# Altium schematic sheet FMC_CONNECTORS.SchDoc: FMC Connectors
size 420 x 297 mm; CheckedBy: T.Janicki; CompanyName: Creotech Instruments SA; DrawnBy: G.Kasprowicz; Organization: CERN; Address1: European Organization for Nuclear Research; Address2: CH-1211 Geneve 23 - Switzerland; DocumentNumber: 10; Revision: -; SheetNumber: 10; SheetTotal: 21; EDA_Number: EDA-xxxx; Projet: Simple VME FMC Carrier; CreateDate: 20/11/2012; CheckedDate: 30/04/2012; DivGrp: BE-CO; Designer: G.Kasprowicz; DocumentName: FMCConnector.SchDoc; ModifiedDate: -; Rule: PcbType=ProtelPcb
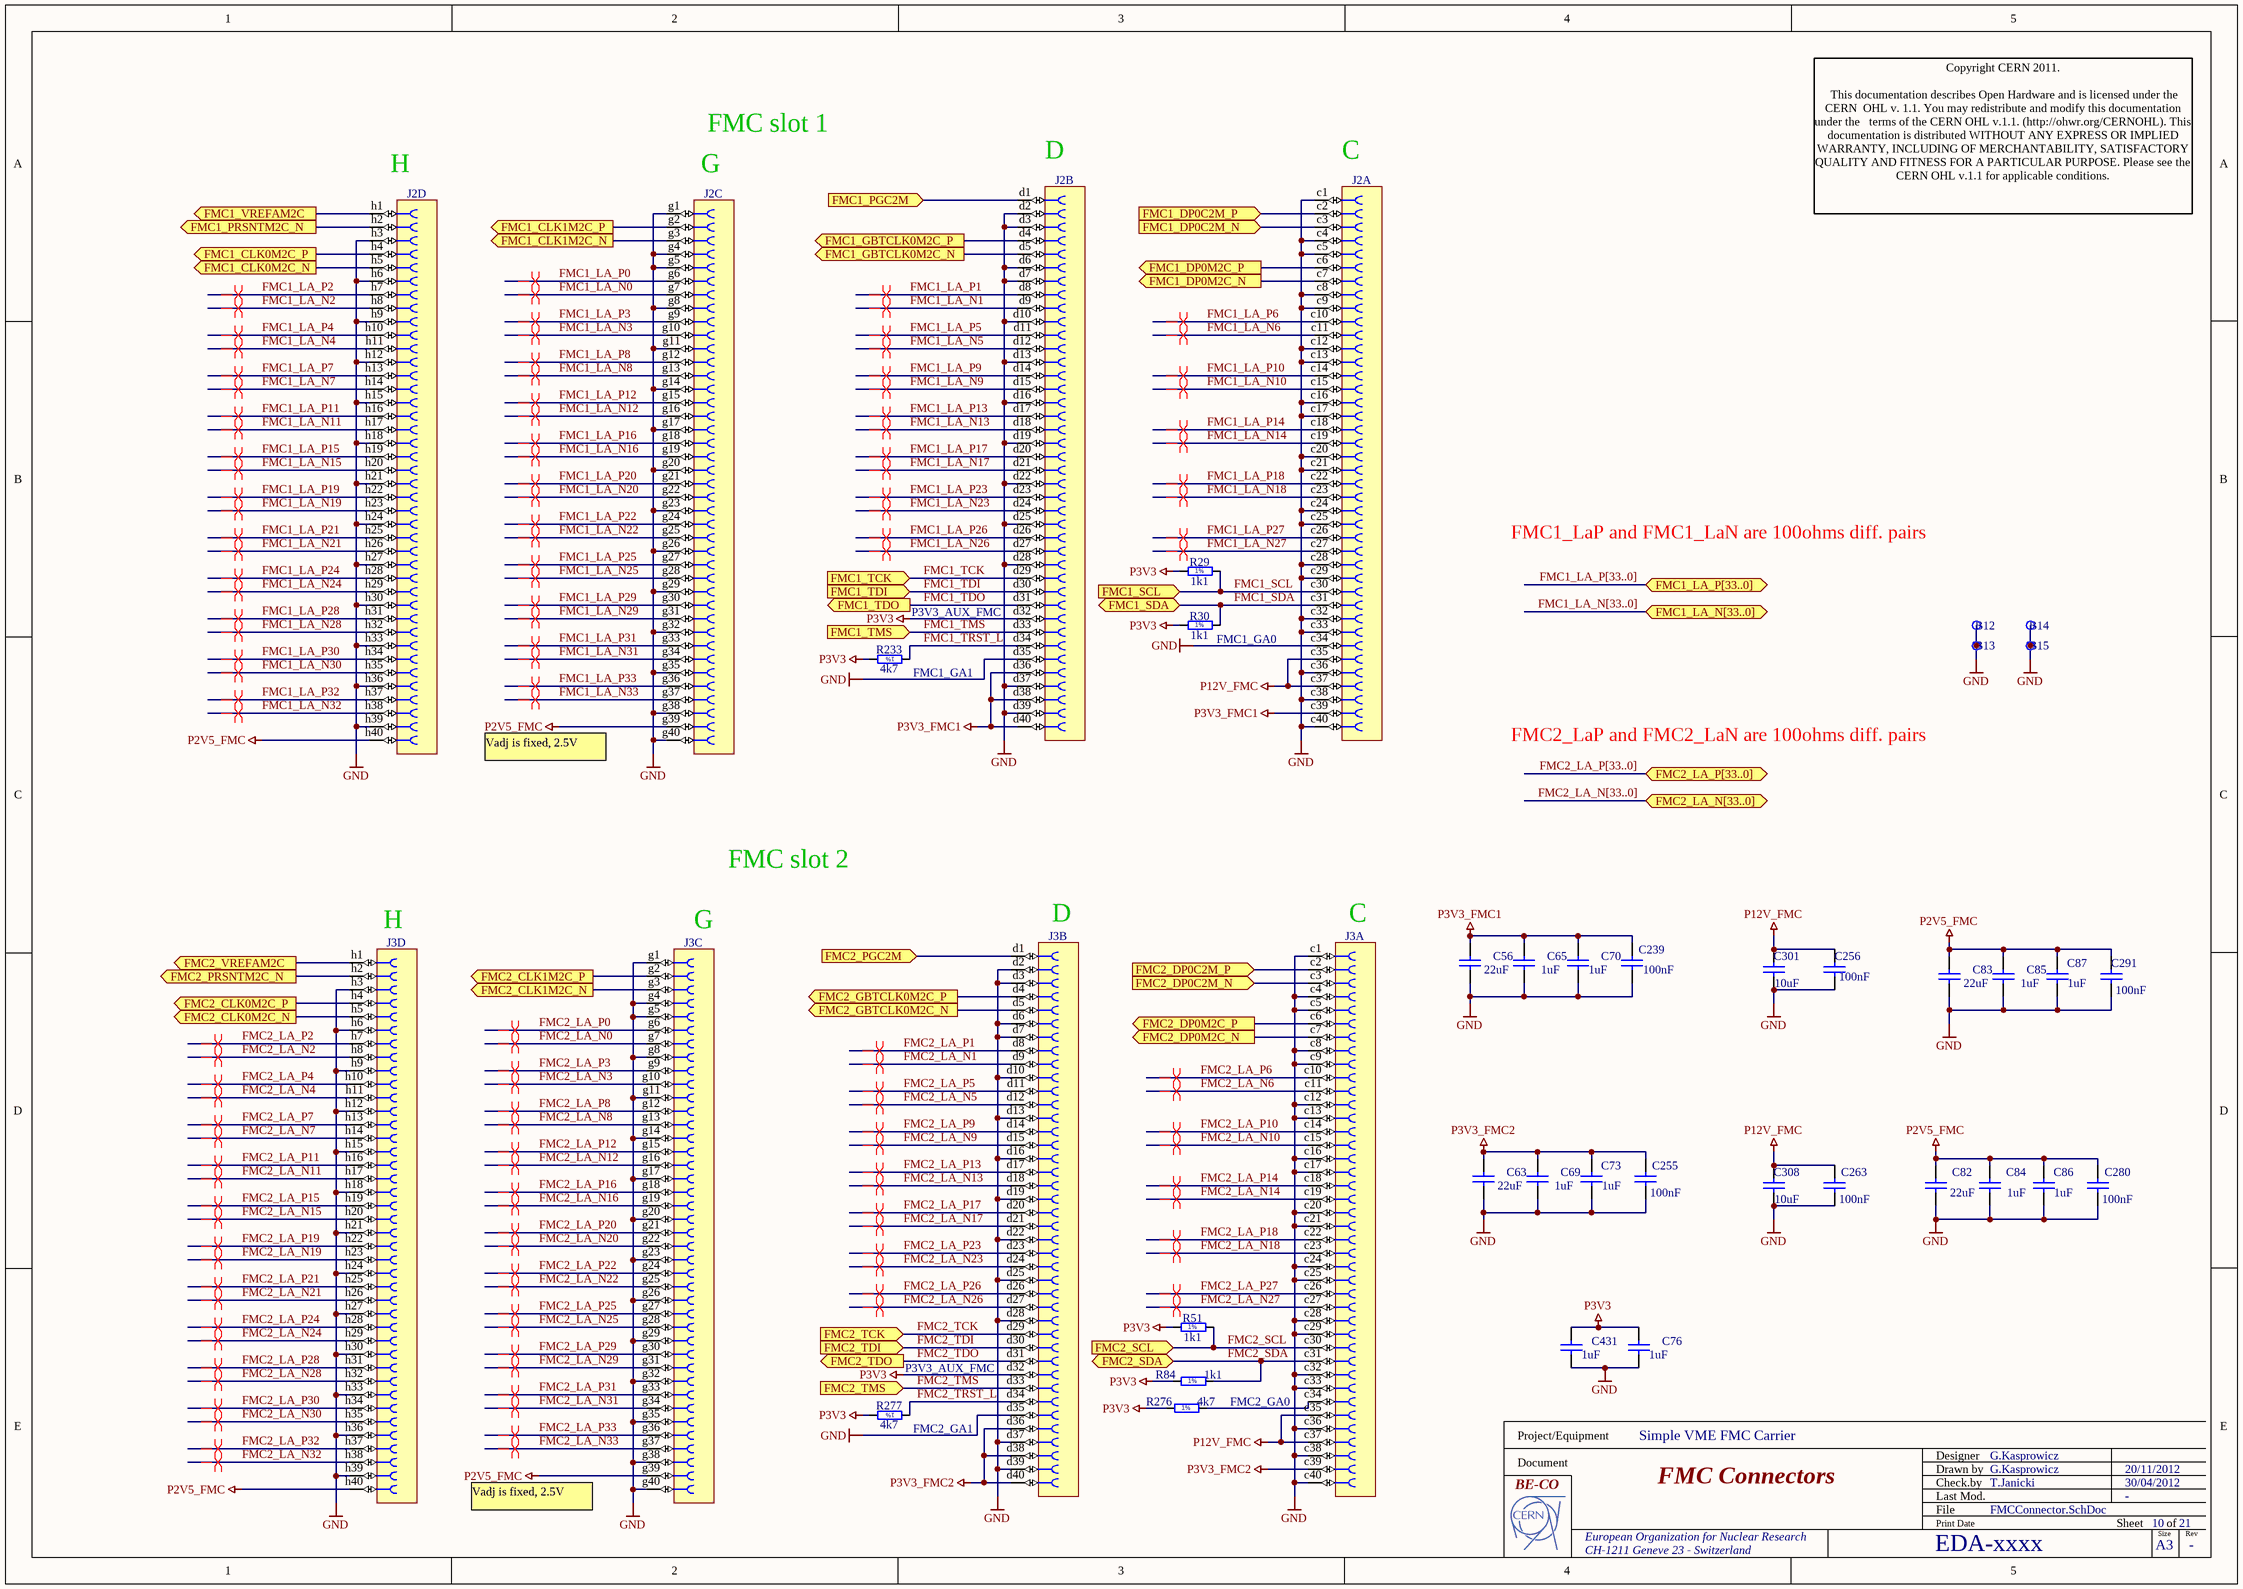
[diagram p0: FMC_CONNECTORS.SchDoc]

## Parts
B12  Plated Hole  [MTG270_500]  (value not drawn)
B13  Plated Hole  [MTG270_500]  (value not drawn)
B14  Plated Hole  [MTG270_500]  (value not drawn)
B15  Plated Hole  [MTG270_500]  (value not drawn)
C56  22uF  [CAPC3216X180N]
C63  22uF  [CAPC3216X180N]
C65  1uF  [CAPC1608X87N]
C69  1uF  [CAPC1608X87N]
C70  1uF  [CAPC1608X87N]
C73  1uF  [CAPC1608X87N]
C76  1uF  [CAPC1608X87N]
C82  22uF  [CAPC3216X180N]
C83  22uF  [CAPC3216X180N]
C84  1uF  [CAPC1608X87N]
C85  1uF  [CAPC1608X87N]
C86  1uF  [CAPC1608X87N]
C87  1uF  [CAPC1608X87N]
C239  100nF  [CAPC1005X55N]
C255  100nF  [CAPC1005X55N]
C256  100nF  [CAPC1005X55N]
C263  100nF  [CAPC1005X55N]
C280  100nF  [CAPC1005X55N]
C291  100nF  [CAPC1005X55N]
C301  10uF  [CAPC3225X270N]
C308  10uF  [CAPC3225X270N]
C431  1uF  [CAPC1608X87N]
J2  VITA 57  [SAMTEC_ASP-134603-01]  (value not drawn)  (parts A,B,C,D of 4)
J3  VITA 57  [SAMTEC_ASP-134603-01]  (value not drawn)  (parts A,B,C,D of 4)
R29  1k1  [RESC1608X55N]
R30  1k1  [RESC1608X55N]
R51  1k1  [RESC1608X55N]
R84  1k1  [RESC1608X55N]
R233  4k7  [RESC1608X55N]
R276  4k7  [RESC1608X55N]
R277  4k7  [RESC1608X55N]

## Ports
FMC1_CLK0M2C_N (out), FMC1_CLK0M2C_P (out), FMC1_CLK1M2C_N (out), FMC1_CLK1M2C_P (out), FMC1_DP0C2M_N (in), FMC1_DP0C2M_P (in), FMC1_DP0M2C_N (out), FMC1_DP0M2C_P (out), FMC1_GBTCLK0M2C_N (out), FMC1_GBTCLK0M2C_P (out), FMC1_LA_N[33..0] (bidir), FMC1_LA_P[33..0] (bidir), FMC1_PGC2M (in), FMC1_PRSNTM2C_N (out), FMC1_SCL (in), FMC1_SDA (bidir), FMC1_TCK (in), FMC1_TDI (in), FMC1_TDO (out), FMC1_TMS (in), FMC1_VREFAM2C (out), FMC2_CLK0M2C_N (out), FMC2_CLK0M2C_P (out), FMC2_CLK1M2C_N (out), FMC2_CLK1M2C_P (out), FMC2_DP0C2M_N (in), FMC2_DP0C2M_P (in), FMC2_DP0M2C_N (out), FMC2_DP0M2C_P (out), FMC2_GBTCLK0M2C_N (out), FMC2_GBTCLK0M2C_P (out), FMC2_LA_N[33..0] (bidir), FMC2_LA_P[33..0] (bidir), FMC2_PGC2M (in), FMC2_PRSNTM2C_N (out), FMC2_SCL (in), FMC2_SDA (bidir), FMC2_TCK (in), FMC2_TDI (in), FMC2_TDO (out), FMC2_TMS (in), FMC2_VREFAM2C (out)

## Nets
GND: B12.1 B13.1 B14.1 B15.1 C56.1 C63.1 C65.1 C69.1 C70.1 C73.1 C76.1 C82.1 C83.1 C84.1 C85.1 C86.1 C87.1 C239.1 C255.1 C256.1 C263.1 C280.1 C291.1 C301.2 C308.2 C431.1 J2.c1 J2.c4 J2.c5 J2.c8 J2.c9 J2.c12 J2.c13 J2.c16 J2.c17 J2.c20 J2.c21 J2.c24 J2.c25 J2.c28 J2.c29 J2.c32 J2.c33 J2.c34 J2.c36 J2.c38 J2.c40 J2.d2 J2.d3 J2.d6 J2.d7 J2.d10 J2.d13 J2.d16 J2.d19 J2.d22 J2.d25 J2.d28 J2.d35 J2.d37 J2.d39 J2.g1 J2.g4 J2.g5 J2.g8 J2.g11 J2.g14 J2.g17 J2.g20 J2.g23 J2.g26 J2.g29 J2.g32 J2.g35 J2.g38 J2.g40 J2.h3 J2.h6 J2.h9 J2.h12 J2.h15 J2.h18 J2.h21 J2.h24 J2.h27 J2.h30 J2.h33 J2.h36 J2.h39 J3.c1 J3.c4 J3.c5 J3.c8 J3.c9 J3.c12 J3.c13 J3.c16 J3.c17 J3.c20 J3.c21 J3.c24 J3.c25 J3.c28 J3.c29 J3.c32 J3.c33 J3.c36 J3.c38 J3.c40 J3.d2 J3.d3 J3.d6 J3.d7 J3.d10 J3.d13 J3.d16 J3.d19 J3.d22 J3.d25 J3.d28 J3.d35 J3.d37 J3.d39 J3.g1 J3.g4 J3.g5 J3.g8 J3.g11 J3.g14 J3.g17 J3.g20 J3.g23 J3.g26 J3.g29 J3.g32 J3.g35 J3.g38 J3.g40 J3.h3 J3.h6 J3.h9 J3.h12 J3.h15 J3.h18 J3.h21 J3.h24 J3.h27 J3.h30 J3.h33 J3.h36 J3.h39
P2V5_FMC: C82.2 C83.2 C84.2 C85.2 C86.2 C87.2 C280.2 C291.2 J2.g39 J2.h40 J3.g39 J3.h40
P3V3: C76.2 C431.2 J2.d32 J3.d32 R29.1 R30.1 R51.1 R84.1 R233.2 R276.1 R277.2
P3V3_FMC1: C56.2 C65.2 C70.2 C239.2 J2.c39 J2.d36 J2.d38 J2.d40
P3V3_FMC2: C63.2 C69.2 C73.2 C255.2 J3.c39 J3.d36 J3.d38 J3.d40
P12V_FMC: C256.2 C263.2 C301.1 C308.1 J2.c35 J2.c37 J3.c35 J3.c37
FMC1_CLK0M2C_N: J2.h5 ; port FMC1_CLK0M2C_N
FMC1_CLK0M2C_P: J2.h4 ; port FMC1_CLK0M2C_P
FMC1_CLK1M2C_N: J2.g3 ; port FMC1_CLK1M2C_N
FMC1_CLK1M2C_P: J2.g2 ; port FMC1_CLK1M2C_P
FMC1_DP0C2M_N: J2.c3 ; port FMC1_DP0C2M_N
FMC1_DP0C2M_P: J2.c2 ; port FMC1_DP0C2M_P
FMC1_DP0M2C_N: J2.c7 ; port FMC1_DP0M2C_N
FMC1_DP0M2C_P: J2.c6 ; port FMC1_DP0M2C_P
FMC1_GBTCLK0M2C_N: J2.d5 ; port FMC1_GBTCLK0M2C_N
FMC1_GBTCLK0M2C_P: J2.d4 ; port FMC1_GBTCLK0M2C_P
FMC1_LA_N0: J2.g7
FMC1_LA_N1: J2.d9
FMC1_LA_N2: J2.h8
FMC1_LA_N3: J2.g10
FMC1_LA_N4: J2.h11
FMC1_LA_N5: J2.d12
FMC1_LA_N6: J2.c11
FMC1_LA_N7: J2.h14
FMC1_LA_N8: J2.g13
FMC1_LA_N9: J2.d15
FMC1_LA_N10: J2.c15
FMC1_LA_N11: J2.h17
FMC1_LA_N12: J2.g16
FMC1_LA_N13: J2.d18
FMC1_LA_N14: J2.c19
FMC1_LA_N15: J2.h20
FMC1_LA_N16: J2.g19
FMC1_LA_N17: J2.d21
FMC1_LA_N18: J2.c23
FMC1_LA_N19: J2.h23
FMC1_LA_N20: J2.g22
FMC1_LA_N21: J2.h26
FMC1_LA_N22: J2.g25
FMC1_LA_N23: J2.d24
FMC1_LA_N24: J2.h29
FMC1_LA_N25: J2.g28
FMC1_LA_N26: J2.d27
FMC1_LA_N27: J2.c27
FMC1_LA_N28: J2.h32
FMC1_LA_N29: J2.g31
FMC1_LA_N30: J2.h35
FMC1_LA_N31: J2.g34
FMC1_LA_N32: J2.h38
FMC1_LA_N33: J2.g37
FMC1_LA_P0: J2.g6
FMC1_LA_P1: J2.d8
FMC1_LA_P2: J2.h7
FMC1_LA_P3: J2.g9
FMC1_LA_P4: J2.h10
FMC1_LA_P5: J2.d11
FMC1_LA_P6: J2.c10
FMC1_LA_P7: J2.h13
FMC1_LA_P8: J2.g12
FMC1_LA_P9: J2.d14
FMC1_LA_P10: J2.c14
FMC1_LA_P11: J2.h16
FMC1_LA_P12: J2.g15
FMC1_LA_P13: J2.d17
FMC1_LA_P14: J2.c18
FMC1_LA_P15: J2.h19
FMC1_LA_P16: J2.g18
FMC1_LA_P17: J2.d20
FMC1_LA_P18: J2.c22
FMC1_LA_P19: J2.h22
FMC1_LA_P20: J2.g21
FMC1_LA_P21: J2.h25
FMC1_LA_P22: J2.g24
FMC1_LA_P23: J2.d23
FMC1_LA_P24: J2.h28
FMC1_LA_P25: J2.g27
FMC1_LA_P26: J2.d26
FMC1_LA_P27: J2.c26
FMC1_LA_P28: J2.h31
FMC1_LA_P29: J2.g30
FMC1_LA_P30: J2.h34
FMC1_LA_P31: J2.g33
FMC1_LA_P32: J2.h37
FMC1_LA_P33: J2.g36
FMC1_PGC2M: J2.d1 ; port FMC1_PGC2M
FMC1_PRSNTM2C_N: J2.h2 ; port FMC1_PRSNTM2C_N
FMC1_SCL: J2.c30 R29.2 ; port FMC1_SCL
FMC1_SDA: J2.c31 R30.2 ; port FMC1_SDA
FMC1_TCK: J2.d29 ; port FMC1_TCK
FMC1_TDI: J2.d30 ; port FMC1_TDI
FMC1_TDO: J2.d31 ; port FMC1_TDO
FMC1_TMS: J2.d33 ; port FMC1_TMS
FMC1_TRST_L: J2.d34 R233.1
FMC1_VREFAM2C: J2.h1 ; port FMC1_VREFAM2C
FMC2_CLK0M2C_N: J3.h5 ; port FMC2_CLK0M2C_N
FMC2_CLK0M2C_P: J3.h4 ; port FMC2_CLK0M2C_P
FMC2_CLK1M2C_N: J3.g3 ; port FMC2_CLK1M2C_N
FMC2_CLK1M2C_P: J3.g2 ; port FMC2_CLK1M2C_P
FMC2_DP0C2M_N: J3.c3 ; port FMC2_DP0C2M_N
FMC2_DP0C2M_P: J3.c2 ; port FMC2_DP0C2M_P
FMC2_DP0M2C_N: J3.c7 ; port FMC2_DP0M2C_N
FMC2_DP0M2C_P: J3.c6 ; port FMC2_DP0M2C_P
FMC2_GBTCLK0M2C_N: J3.d5 ; port FMC2_GBTCLK0M2C_N
FMC2_GBTCLK0M2C_P: J3.d4 ; port FMC2_GBTCLK0M2C_P
FMC2_LA_N0: J3.g7
FMC2_LA_N1: J3.d9
FMC2_LA_N2: J3.h8
FMC2_LA_N3: J3.g10
FMC2_LA_N4: J3.h11
FMC2_LA_N5: J3.d12
FMC2_LA_N6: J3.c11
FMC2_LA_N7: J3.h14
FMC2_LA_N8: J3.g13
FMC2_LA_N9: J3.d15
FMC2_LA_N10: J3.c15
FMC2_LA_N11: J3.h17
FMC2_LA_N12: J3.g16
FMC2_LA_N13: J3.d18
FMC2_LA_N14: J3.c19
FMC2_LA_N15: J3.h20
FMC2_LA_N16: J3.g19
FMC2_LA_N17: J3.d21
FMC2_LA_N18: J3.c23
FMC2_LA_N19: J3.h23
FMC2_LA_N20: J3.g22
FMC2_LA_N21: J3.h26
FMC2_LA_N22: J3.g25
FMC2_LA_N23: J3.d24
FMC2_LA_N24: J3.h29
FMC2_LA_N25: J3.g28
FMC2_LA_N26: J3.d27
FMC2_LA_N27: J3.c27
FMC2_LA_N28: J3.h32
FMC2_LA_N29: J3.g31
FMC2_LA_N30: J3.h35
FMC2_LA_N31: J3.g34
FMC2_LA_N32: J3.h38
FMC2_LA_N33: J3.g37
FMC2_LA_P0: J3.g6
FMC2_LA_P1: J3.d8
FMC2_LA_P2: J3.h7
FMC2_LA_P3: J3.g9
FMC2_LA_P4: J3.h10
FMC2_LA_P5: J3.d11
FMC2_LA_P6: J3.c10
FMC2_LA_P7: J3.h13
FMC2_LA_P8: J3.g12
FMC2_LA_P9: J3.d14
FMC2_LA_P10: J3.c14
FMC2_LA_P11: J3.h16
FMC2_LA_P12: J3.g15
FMC2_LA_P13: J3.d17
FMC2_LA_P14: J3.c18
FMC2_LA_P15: J3.h19
FMC2_LA_P16: J3.g18
FMC2_LA_P17: J3.d20
FMC2_LA_P18: J3.c22
FMC2_LA_P19: J3.h22
FMC2_LA_P20: J3.g21
FMC2_LA_P21: J3.h25
FMC2_LA_P22: J3.g24
FMC2_LA_P23: J3.d23
FMC2_LA_P24: J3.h28
FMC2_LA_P25: J3.g27
FMC2_LA_P26: J3.d26
FMC2_LA_P27: J3.c26
FMC2_LA_P28: J3.h31
FMC2_LA_P29: J3.g30
FMC2_LA_P30: J3.h34
FMC2_LA_P31: J3.g33
FMC2_LA_P32: J3.h37
FMC2_LA_P33: J3.g36
FMC2_PGC2M: J3.d1 ; port FMC2_PGC2M
FMC2_PRSNTM2C_N: J3.h2 ; port FMC2_PRSNTM2C_N
FMC2_SCL: J3.c30 R51.2 ; port FMC2_SCL
FMC2_SDA: J3.c31 R84.2 ; port FMC2_SDA
FMC2_TCK: J3.d29 ; port FMC2_TCK
FMC2_TDI: J3.d30 ; port FMC2_TDI
FMC2_TDO: J3.d31 ; port FMC2_TDO
FMC2_TMS: J3.d33 ; port FMC2_TMS
FMC2_TRST_L: J3.d34 R277.1
FMC2_VREFAM2C: J3.h1 ; port FMC2_VREFAM2C
NetJ3_c34: J3.c34 R276.2

## Buses and harness runs
bus FMC1_LA_N[33..0] = port FMC1_LA_N[33..0]
bus FMC1_LA_P[33..0] = port FMC1_LA_P[33..0]
bus FMC2_LA_N[33..0] = port FMC2_LA_N[33..0]
bus FMC2_LA_P[33..0] = port FMC2_LA_P[33..0]

## Layout directives
differential pair: FMC1_LA_N0, FMC1_LA_N1, FMC1_LA_N2, FMC1_LA_N3, FMC1_LA_N4, FMC1_LA_N5, FMC1_LA_N6, FMC1_LA_N7, FMC1_LA_N8, FMC1_LA_N9, FMC1_LA_N10, FMC1_LA_N11, FMC1_LA_N12, FMC1_LA_N13, FMC1_LA_N14, FMC1_LA_N15, FMC1_LA_N16, FMC1_LA_N17, FMC1_LA_N18, FMC1_LA_N19, FMC1_LA_N20, FMC1_LA_N21, FMC1_LA_N22, FMC1_LA_N23, FMC1_LA_N24, FMC1_LA_N25, FMC1_LA_N26, FMC1_LA_N27, FMC1_LA_N28, FMC1_LA_N29, FMC1_LA_N30, FMC1_LA_N31, FMC1_LA_N32, FMC1_LA_N33, FMC1_LA_P0, FMC1_LA_P1, FMC1_LA_P2, FMC1_LA_P3, FMC1_LA_P4, FMC1_LA_P5, FMC1_LA_P6, FMC1_LA_P7, FMC1_LA_P8, FMC1_LA_P9, FMC1_LA_P10, FMC1_LA_P11, FMC1_LA_P12, FMC1_LA_P13, FMC1_LA_P14, FMC1_LA_P15, FMC1_LA_P16, FMC1_LA_P17, FMC1_LA_P18, FMC1_LA_P19, FMC1_LA_P20, FMC1_LA_P21, FMC1_LA_P22, FMC1_LA_P23, FMC1_LA_P24, FMC1_LA_P25, FMC1_LA_P26, FMC1_LA_P27, FMC1_LA_P28, FMC1_LA_P29, FMC1_LA_P30, FMC1_LA_P31, FMC1_LA_P32, FMC1_LA_P33, FMC2_LA_N0, FMC2_LA_N1, FMC2_LA_N2, FMC2_LA_N3, FMC2_LA_N4, FMC2_LA_N5, FMC2_LA_N6, FMC2_LA_N7, FMC2_LA_N8, FMC2_LA_N9, FMC2_LA_N10, FMC2_LA_N11, FMC2_LA_N12, FMC2_LA_N13, FMC2_LA_N14, FMC2_LA_N15, FMC2_LA_N16, FMC2_LA_N17, FMC2_LA_N18, FMC2_LA_N19, FMC2_LA_N20, FMC2_LA_N21, FMC2_LA_N22, FMC2_LA_N23, FMC2_LA_N24, FMC2_LA_N25, FMC2_LA_N26, FMC2_LA_N27, FMC2_LA_N28, FMC2_LA_N29, FMC2_LA_N30, FMC2_LA_N31, FMC2_LA_N32, FMC2_LA_N33, FMC2_LA_P0, FMC2_LA_P1, FMC2_LA_P2, FMC2_LA_P3, FMC2_LA_P4, FMC2_LA_P5, FMC2_LA_P6, FMC2_LA_P7, FMC2_LA_P8, FMC2_LA_P9, FMC2_LA_P10, FMC2_LA_P11, FMC2_LA_P12, FMC2_LA_P13, FMC2_LA_P14, FMC2_LA_P15, FMC2_LA_P16, FMC2_LA_P17, FMC2_LA_P18, FMC2_LA_P19, FMC2_LA_P20, FMC2_LA_P21, FMC2_LA_P22, FMC2_LA_P23, FMC2_LA_P24, FMC2_LA_P25, FMC2_LA_P26, FMC2_LA_P27, FMC2_LA_P28, FMC2_LA_P29, FMC2_LA_P30, FMC2_LA_P31, FMC2_LA_P32, FMC2_LA_P33

## Notes on the sheet
- (near J2) H
- (near J2) G
- FMC slot 1
- (near J2) D
- (near J2) C
- Copyright CERN 2011.
  This documentation describes Open Hardware and is licensed under the CERN  OHL v. 1.1. You may redistribute and modify this documentation under the   terms of the CERN OHL v.1.1. (http://ohwr.org/CERNOHL). This  documentation is distributed WITHOUT ANY EXPRESS OR IMPLIED  WARRANTY, INCLUDING OF MERCHANTABILITY, SATISFACTORY  QUALITY AND FITNESS FOR A PARTICULAR PURPOSE. Please see the  CERN OHL v.1.1 for applicable conditions.
- FMC1_LaP and FMC1_LaN are 100ohms diff. pairs
- (near R233) FMC1_GA1
- P3V3_AUX_FMC
- (near R30) FMC1_GA0
- Vadj is fixed, 2.5V
- FMC2_LaP and FMC2_LaN are 100ohms diff. pairs
- (near J3) H
- (near J3) G
- FMC slot 2
- (near J3) D
- (near J3) C
- FMC2_GA0
- (near R277) FMC2_GA1
- Project/Equipment
- Document
- Designer
- Drawn by
- Check.by
- File
- Last Mod.
- Print Date
- Sheet
- Size
- A3
- of
- Rev
- (in symbol R0603_1K1_1%_0.1W_100PPM) 1%
- (in symbol R0603_4K7_1%_0.1W_100PPM) 1%

## Library data of the parts
B12-B15 = PLATED_HOLE2.7_PAD5.0: Single Terminal Socket; Part Description: Plated Through Hole: Hole Dia.=2.7mm Pad Dia.=5.0mm; Mounted: No; Table: Pads; Part Number: PLATED_HOLE2.7_PAD5.0; Component Kind: Standard (No BOM); Component Type: Standard (No BOM); Pin Count: 1; Family: Plated Hole; Socket: No; SMD: No; Status: None; ComponentHeight: 0mm; Author: CERN DEM JMW; CreateDate: 2011-09-27; LatestRevisionDate: 2011-09-27; PackageDescription: Plated Through Hole: Hole Dia.=2.7mm Pad Dia.=5.0mm
C56 C63 C82 C83 = CC1206_22UF_10V_10%_X7R: Non-polarised capacitor; Part Description: SMD Multilayer Chip Ceramic Capacitor; Manufacturer: GENERIC; Manufacturer1 Part Number: GRM31CR71A226KE15L; Voltage: 10V; TC: X7R; Tolerance: ±10%; Table: Capacitors SMD; Part Number: CC1206_22UF_10V_10%_X7R; Component Kind: Standard; Component Type: Standard; Pin Count: 2; Value: 22uF; Status: Preferred; Manufacturer Part Number: CC1206_22UF_10V_10%_X7R; Case: 1206; Mounted: Yes; Socket: No; SMD: Yes; Manufacturer1 Example: MURATA; Manufacturer1 ComponentHeight: 1.8mm; HelpURL: \\cern.ch\dfs\Applications\Altium\Datasheets\CC1206_X7R_MURATA_GRM-HI-CAP.pdf; Author: CERN DEM JLC; CreateDate: 2010-06-08; LatestRevisionDate: 2010-06-08
C65 C69 C70 C73 C76 C84-C87 C431 = CC0603_1UF_16V_10%_X7R: Non-polarised capacitor; Part Description: SMD Multilayer Chip Ceramic Capacitor; Manufacturer: GENERIC; Manufacturer1 Part Number: 223824613663; Voltage: 16V; TC: X7R; Tolerance: ±10%; Table: Capacitors SMD; Part Number: CC0603_1UF_16V_10%_X7R; Component Kind: Standard; Component Type: Standard; Pin Count: 2; Value: 1uF; Status: Preferred; Manufacturer Part Number: CC0603_1uF_16V_10%_X7R; Case: 0603; Mounted: Yes; Socket: No; SMD: Yes; Manufacturer1 Example: PHYCOMP; Manufacturer1 ComponentHeight: 0.87mm; HelpURL: \\cern.ch\dfs\Applications\Altium\Datasheets\CC0805_X5R_PHYCOMP_HC.pdf; Author: CERN DEM JLC
  C65 C69 C84 C85: CreateDate: 12/3/2007; LatestRevisionDate: 12/3/2007
  C70 C73 C76 C86 C87 C431: CreateDate: 03/12/2007; LatestRevisionDate: 03/12/2007
C239 C255 C256 C263 C280 C291 = CC0402_100NF_16V_10%_X7R: Non-polarised capacitor; Part Description: SMD Multilayer Chip Ceramic Capacitor; Manufacturer: GENERIC; Manufacturer1 Part Number: 223878715649; Voltage: 16V; TC: X7R; Tolerance: ±10%; Table: Capacitors SMD; Part Number: CC0402_100NF_16V_10%_X7R; Component Kind: Standard; Component Type: Standard; Pin Count: 2; Value: 100nF; Status: Not Recommended; Manufacturer Part Number: CC0402_100NF_16V_10%_X7R; Case: 0402; Mounted: Yes; Socket: No; SMD: Yes; Manufacturer1 Example: PHYCOMP; Manufacturer1 ComponentHeight: 0.55mm; HelpURL: \\cern.ch\dfs\Applications\Altium\Datasheets\CC0402_X7R_PHYCOMP.pdf; Author: CERN DEM JLC; CreateDate: 2007-12-03; LatestRevisionDate: 2007-12-03
C301 C308 = CC1210_10UF_25V_10%_X7R: Non-polarised capacitor; Part Description: SMD Multilayer Chip Ceramic Capacitor; Manufacturer: GENERIC; Manufacturer1 Part Number: C1210C106K3RAC; Voltage: 25V; TC: X7R; Tolerance: ±10%; Table: Capacitors SMD; Part Number: CC1210_10UF_25V_10%_X7R; Component Kind: Standard; Component Type: Standard; Pin Count: 2; Value: 10uF; Status: None; Manufacturer Part Number: CC1210_10UF_25V_10%_X7R; Case: 1210; Mounted: Yes; Socket: No; SMD: Yes; Manufacturer1 Example: KEMET; Manufacturer1 ComponentHeight: 2.7mm; HelpURL: \\cern.ch\dfs\Applications\Altium\Datasheets\CC1210_X7R_KEMET.pdf; Author: CERN DEM JLC; CreateDate: 5/5/2009; LatestRevisionDate: 4/1/2010
J2 J3 = SAMTEC_ASP-134603-01: Connector VITA 57, 160 Female contacts in 4 row cdgh; Part Description: 160 contacts (4 rows cdgh) Surface Mount Female Connector, VITA 57 (CC-LPC-10); Manufacturer: SAMTEC; Part Number: SAMTEC_ASP-134603-01; Component Kind: Standard; Component Type: Standard; Pin Count: 160; Family: VITA 57; Mounted: Yes; Socket: No; SMD: Yes; Status: None; Manufacturer Part Number: ASP-134603-01; ComponentHeight: 6.55mm; HelpURL: \\cern.ch\dfs\Applications\Altium\Datasheets\SAMTEC_ASP-134603-01.pdf; Author: CERN DEM JLC; CreateDate: 2010-07-13; LatestRevisionDate: 2010-07-13; Table: SAMTEC
R29 R30 R51 R84 = R0603_1K1_1%_0.1W_100PPM: Resistor - 1%; Part Description: General Purpose Thick Film Chip Resistor; Manufacturer: GENERIC; Manufacturer1 Part Number: NRC06F1101TRF; Power: 0.1W; TC: ±100ppm/°C; Table: Resistors SMD; Part Number: R0603_1K1_1%_0.1W_100PPM; Component Kind: Standard; Component Type: Standard; Pin Count: 2; Value: 1k1; Status: Preferred; Tolerance: ±1%; Manufacturer Part Number: R0603_1K1_1%_0.1W_100PPM; Case: 0603; Mounted: Yes; Socket: No; SMD: Yes; Manufacturer1 Example: NIC COMPONENT; Manufacturer1 ComponentHeight: 0.55mm; HelpURL: \\cern.ch\dfs\Applications\Altium\Datasheets\R0603_NIC_NRC.pdf; Author: CERN DEM JLC; CreateDate: 2007-12-03; LatestRevisionDate: 2008-03-13
R233 R276 R277 = R0603_4K7_1%_0.1W_100PPM: Resistor - 1%; Part Description: General Purpose Thick Film Chip Resistor; Manufacturer: GENERIC; Manufacturer1 Part Number: NRC06F4701TRF; Power: 0.1W; TC: ±100ppm/°C; Table: Resistors SMD; Part Number: R0603_4K7_1%_0.1W_100PPM; Component Kind: Standard; Component Type: Standard; Pin Count: 2; Value: 4k7; Status: Preferred; Tolerance: ±1%; Manufacturer Part Number: R0603_4K7_1%_0.1W_100PPM; Case: 0603; Mounted: Yes; Socket: No; SMD: Yes; Manufacturer1 Example: NIC COMPONENT; Manufacturer1 ComponentHeight: 0.55mm; HelpURL: \\cern.ch\dfs\Applications\Altium\Datasheets\R0603_NIC_NRC.pdf; Author: CERN DEM JLC; CreateDate: 03/12/2007; LatestRevisionDate: 13/03/2008